# EAGLE schematic v5-Power-Section (EAGLE 7.5.0)
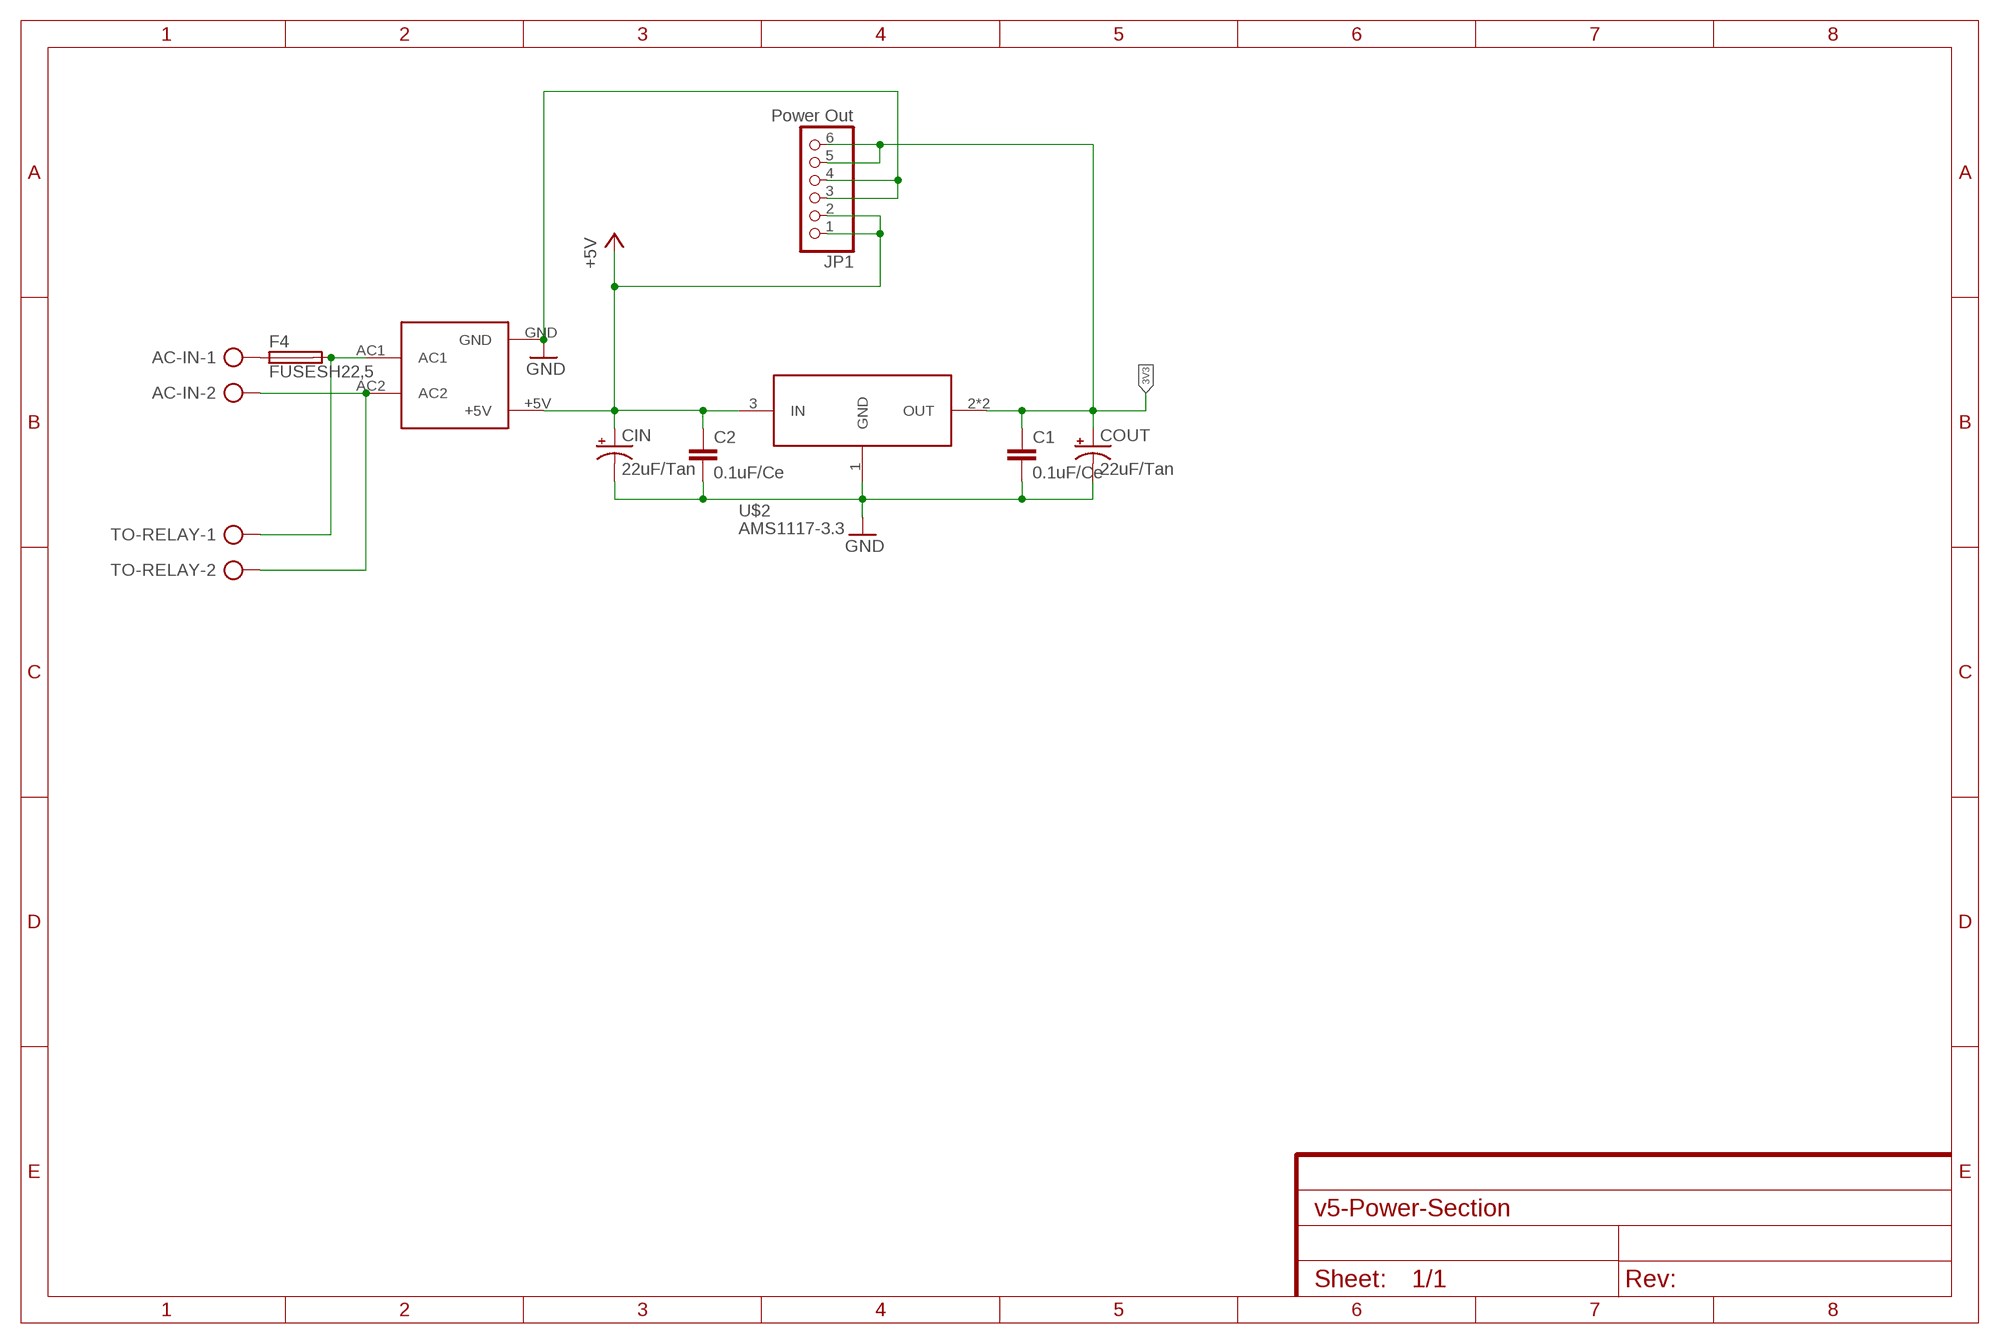
[diagram p0: schematic, sheet 1]

## Parts
AC-IN  AK300/2  [AK300/2]
C1  0.1uF/Ce  C-EU025-024X044  [C025-024X044]
C2  0.1uF/Ce  C-EU025-024X044  [C025-024X044]
CIN  22uF/Tan  CPOL-USE2.5-5  [E2,5-5]
COUT  22uF/Tan  CPOL-USE2.5-5  [E2,5-5]
F4  FUSESH22,5  [SH22,5]
JP1  Power Out  PINHD-1X6  [1X06]
TO-RELAY  AK300/2  [AK300/2]
U$1  HLK-PM01  [HLK-PM01]
U$2  AMS1117-3.3  [SOT-223]

## Nets
3V3: C1.1 COUT.+ JP1.5 JP1.6 U$2.2(OUT) U$2.4(OUT)
+5V: C2.1 CIN.+ JP1.1 JP1.2 U$1.+5V U$2.3(IN)
GND: C1.2 C2.2 CIN.- COUT.- JP1.3 JP1.4 U$1.GND U$2.1(GND)
N$1: AC-IN.1 F4.1
N$2: AC-IN.2 TO-RELAY.2 U$1.AC2
RELAY-NO: F4.2 TO-RELAY.1 U$1.AC1

## Library data of the parts
AC-IN TO-RELAY = con-ptr500:AK300/2: CONNECTOR; OC_FARNELL: unknown; OC_NEWARK: unknown
C1 C2 = rcl:C-EU: CAPACITOR, European symbol
CIN COUT = rcl:CPOL-US: POLARIZED CAPACITOR, American symbol
F4 = fuse:FUSE: Fuse; OC_FARNELL: unknown; OC_NEWARK: unknown
JP1 = pinhead:PINHD-1X6: PIN HEADER
U$1 = HLK-PM01:HLK-PM01
U$2 = AMS1117-3.3:AMS1117-3.3: 1A LOW DROPOUT VOLTAGE REGULATOR